# Altium schematic sheet Function Genetrator off.SchDoc
size A1; SheetNumber: 1; SheetTotal: 1
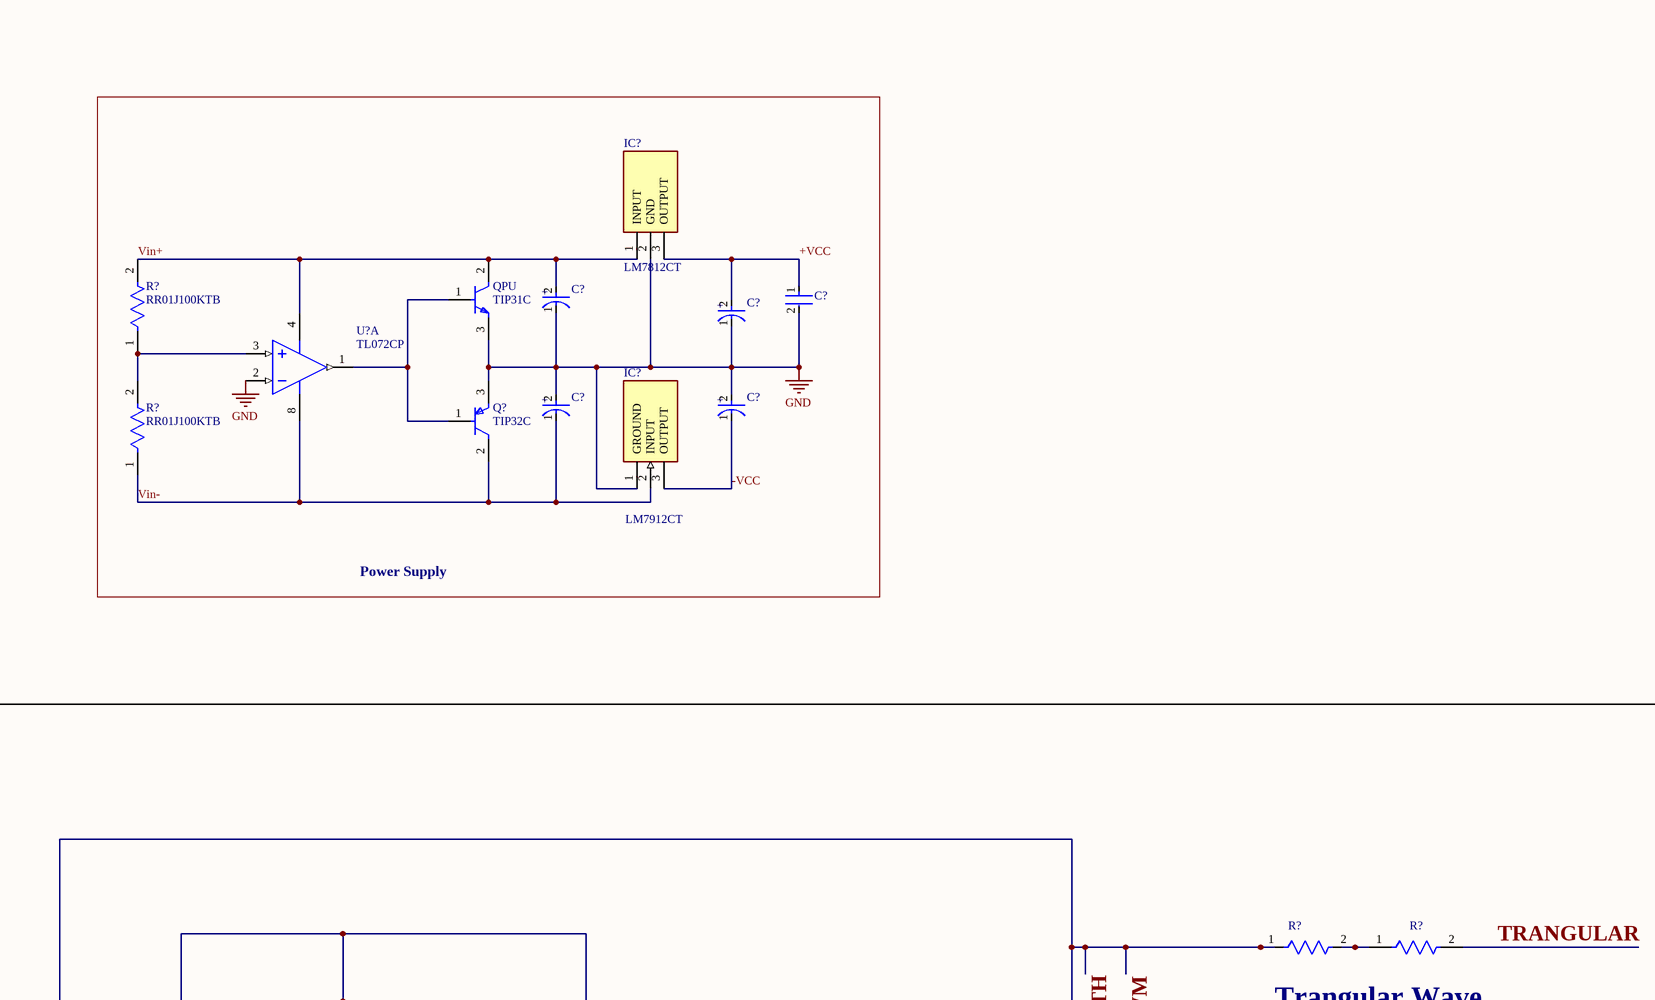
[diagram p0: Function Genetrator off.SchDoc, top left]
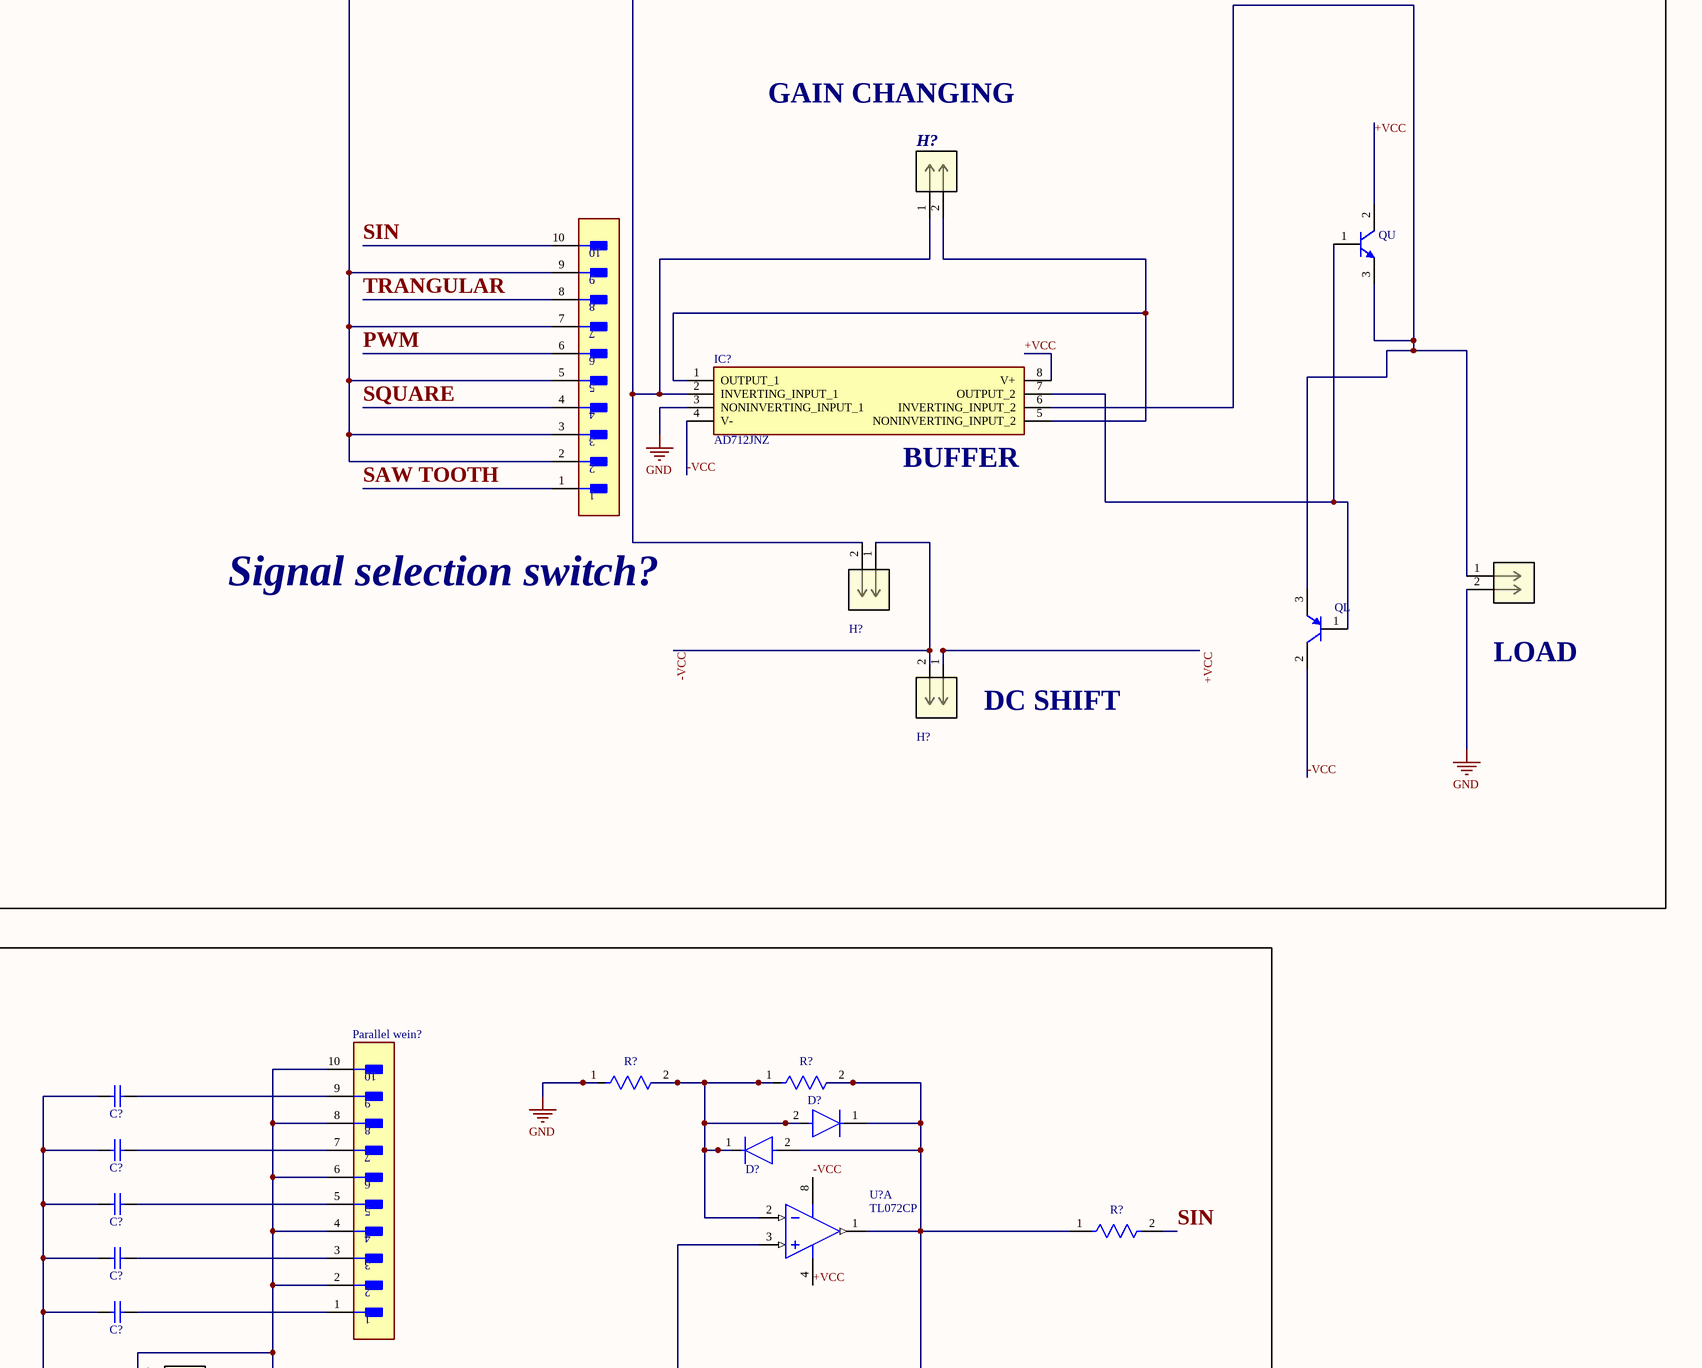
[diagram p1: Function Genetrator off.SchDoc, top right]
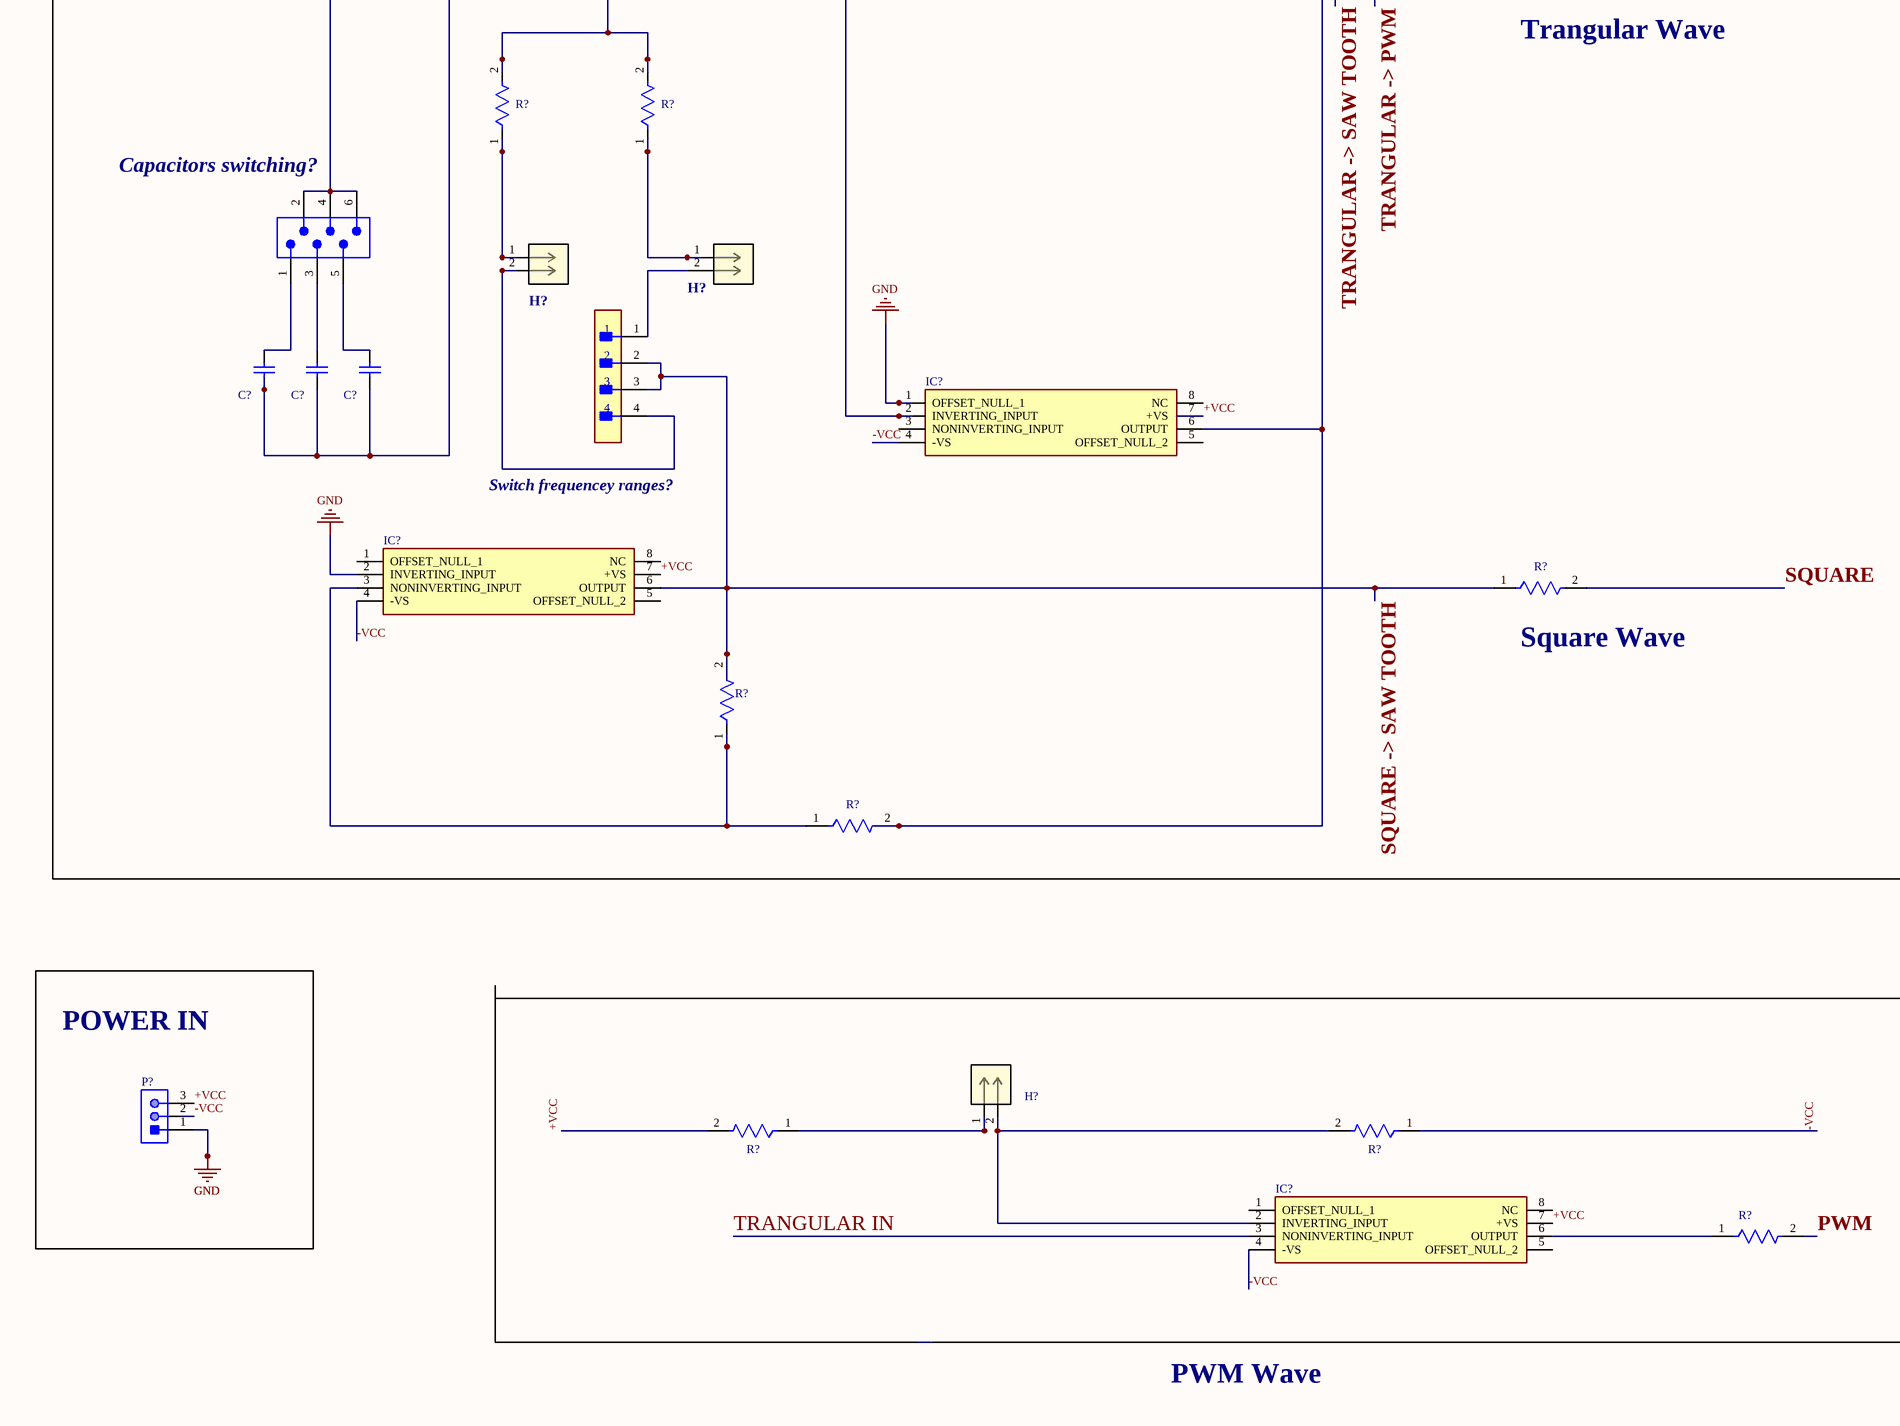
[diagram p2: Function Genetrator off.SchDoc, bottom left]
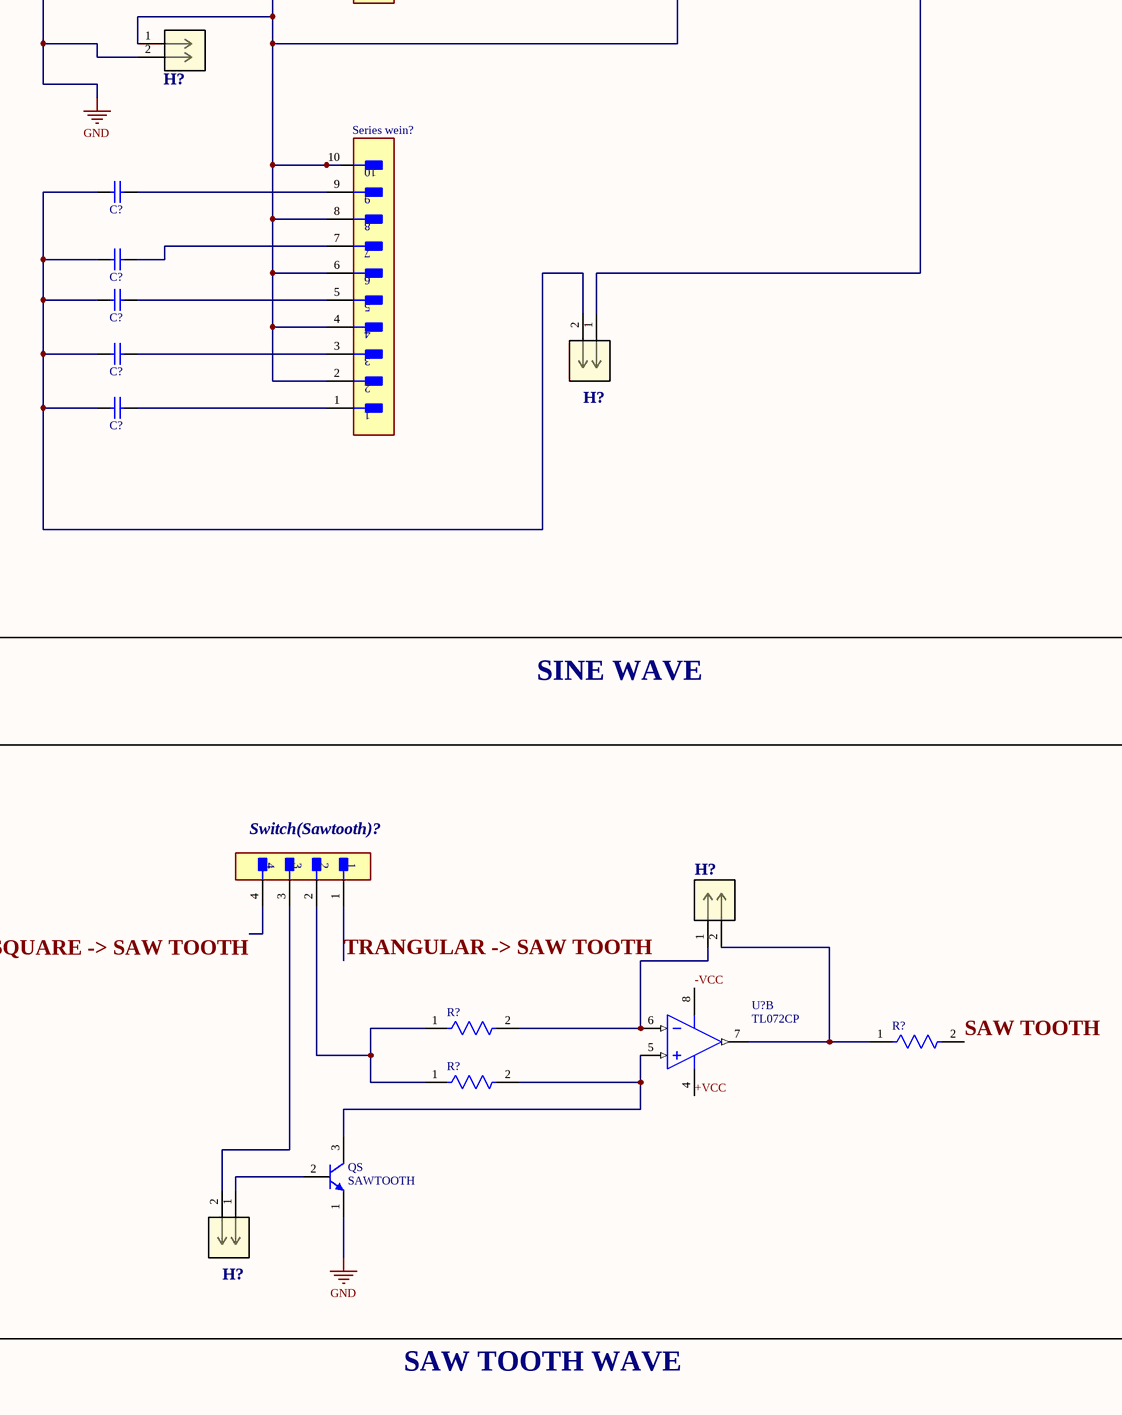
[diagram p3: Function Genetrator off.SchDoc, bottom right]

## Parts
(Parts that share a designator on the sheet are numbered #1, #2 ... from top to bottom, then left to right.)
C?#1  EEUFR1E391L  [FP-RAD-TH-D_8_0_5-L_15_1-MFG]  (value not drawn)
C?#2  RCER72A104K1A2H03B  [FP-RCE1A2-MFG]  (value not drawn)
C?#3  EEUFR1E391L  [FP-RAD-TH-D_8_0_5-L_15_1-MFG]  (value not drawn)
C?#4  EEUFR1E391L  [FP-RAD-TH-D_8_0_5-L_15_1-MFG]  (value not drawn)
C?#5  EEUFR1E391L  [FP-RAD-TH-D_8_0_5-L_15_1-MFG]  (value not drawn)
C?#6  10uF  [KEMT-C333C105M5U5TA-2]  (value not drawn)
C?#7  1uF  [KEMT-C333C105M5U5TA-2]  (value not drawn)
C?#8  100nF  [KEMT-C333C105M5U5TA-2]  (value not drawn)
C?#9  10nF  [KEMT-C333C105M5U5TA-2]  (value not drawn)
C?#10  1nF  [KEMT-C333C105M5U5TA-2]  (value not drawn)
C?#11  10uF  [KEMT-C333C105M5U5TA-2]  (value not drawn)
C?#12  1uF  [KEMT-C333C105M5U5TA-2]  (value not drawn)
C?#13  100nF  [KEMT-C333C105M5U5TA-2]  (value not drawn)
C?#14  10nF  [KEMT-C333C105M5U5TA-2]  (value not drawn)
C?#15  1uF  [KEMT-C333C105M5U5TA-2]  (value not drawn)
C?#16  0.1uF  [KEMT-C333C105M5U5TA-2]  (value not drawn)
C?#17  0.01uF  [KEMT-C333C105M5U5TA-2]  (value not drawn)
C?#18  1nF  [KEMT-C333C105M5U5TA-2]  (value not drawn)
Capacitors_switching?  690357100672  [690357100672]  (value not drawn)
D?#1  1N4148  [FP-017AG-MFG]  (value not drawn)
D?#2  1N4148  [FP-017AG-MFG]  (value not drawn)
H?#1  100kohm potentiometer  [2Pins_AMP]  (value not drawn)
H?#2  10Kohm Potentiometer  [2Pins_AMP]  (value not drawn)
H?#3  10Kohm Potentiometer  [2Pins_AMP]  (value not drawn)
H?#4  10Kohm potentiometer  [2Pins_AMP]  (value not drawn)
H?#5  10KOHM POTENTIOMETER  [2Pins_AMP]  (value not drawn)
H?#6  200KOHM POTENTIOMETER  [2Pins_AMP]  (value not drawn)
H?#7  10Kohm potentiometer  [2Pins_AMP]  (value not drawn)
H?#8  10Kohm potentiometer  [2Pins_AMP]  (value not drawn)
H?#9  5Kohm Potentiometer  [2Pins_AMP]  (value not drawn)
H?#10  100KOHM POTENTIOMETER  [2Pins_AMP]  (value not drawn)
IC?#1  AD712JNZ  [DIP794W56P254L959H533Q8N]
IC?#2  LM7812CT  [TO254P470X1016X2019-3P]
IC?#3  LM7912CT  [TO254P483X1016X2261-3P]
IC?#4  AD711JN  [DIP794W56P254L928H457Q8N]  (value not drawn)
IC?#5  AD711JN  [DIP794W56P254L928H457Q8N]  (value not drawn)
IC?#6  AD711JN  [DIP794W56P254L928H457Q8N]  (value not drawn)
LOAD  67997-402HLF  [2Pins_AMP]  (value not drawn)
P?  292161-3  [TECO-292161-3_V]  (value not drawn)
Parallel_wein?  in 1  [FP-4-644456-0-MFG]  (value not drawn)
Q?  TIP32C  [FP-TO-220-P0A0015988-MFG]
QL  TIP32A  [ONSC-TO-220-3-221A-09]  (value not drawn)
QPU  TIP31C  [FP-TO-220-P0A0015988-MFG]
QS  SAWTOOTH  [FAIR-TO-92]
QU  TIP31A  [ONSC-TO-220-3-221A-09]  (value not drawn)
R?#1  RR01J100KTB  [FP-RR01-MFG]
R?#2  RR01J100KTB  [FP-RR01-MFG]
R?#3  5K  [FP-MBB0207-MFG]  (value not drawn)
R?#4  10K  [FP-MBB0207-MFG]  (value not drawn)
R?#5  0.5K  [FP-MBB0207-MFG]  (value not drawn)
R?#6  6.8K  [FP-MBB0207-MFG]  (value not drawn)
R?#7  10K  [FP-MBB0207-MFG]  (value not drawn)
R?#8  150ohm  [FP-RLR07-MFG]  (value not drawn)
R?#9  10K  [FP-RLR07-MFG]  (value not drawn)
R?#10  10K  [FP-MBB0207-MFG]  (value not drawn)
R?#11  1K  [FP-MBB0207-MFG]  (value not drawn)
R?#12  150OHM  [FP-MBB0207-MFG]  (value not drawn)
R?#13  10K  [FP-MBB0207-MFG]  (value not drawn)
R?#14  10k  [FP-MBB0207-MFG]  (value not drawn)
R?#15  10K  [FP-MBB0207-MFG]  (value not drawn)
R?#16  10K  [FP-MBB0207-MFG]  (value not drawn)
R?#17  10K  [FP-MBB0207-MFG]  (value not drawn)
R?#18  68Kohm  [FP-MBB0207-MFG]  (value not drawn)
Series_wein?  in2  [FP-4-644456-0-MFG]  (value not drawn)
Signal_selection_switch?  4-644456-0  [FP-4-644456-0-MFG]  (value not drawn)
Switch(Sawtooth)?  HTSW-102-07-G-D  [FP-HTSW-102-07-G-D-MFG]  (value not drawn)
Switch_frequencey_ranges?  FREQ  [FP-HTSW-102-07-G-D-MFG]  (value not drawn)
U?#1  TL072CP  [P0008A]  (part A of 2)
U?#2  TL072CP  [P0008A]  (part A of 2)
U?#3  TL072CP  [P0008A]  (part B of 2)

## Blocks framed on the sheet
Power Supply: C?#1-C?#5 IC?#2 IC?#3 Q? QPU R?#1 R?#2 U?#1
POWER IN: P?

## Nets
GND: C?#1.1(C) C?#2.2 C?#3.1(C) C?#4.2(A) C?#5.2(A) C?#6.2 C?#7.2 C?#8.2 C?#9.2 C?#10.2 H?#4.2 IC?#1.3(NONINVERTING_INPUT_1) IC?#2.2(GND) IC?#3.1(GROUND) IC?#4.1(OFFSET_NULL_1) IC?#5.2(INVERTING_INPUT) LOAD.2 P?.1 Q?.3(E) QPU.3(E) QS.1(E) R?#3.1 U?#1.2(IN1-)
+VCC: C?#2.1 C?#3.2(A) H?#3.1 IC?#1.8(V+) IC?#2.3(OUTPUT) IC?#4.7(+VS) IC?#5.7(+VS) IC?#6.7(+VS) P?.3 QU.2(C) R?#16.2 U?#2.4(VCC-) U?#3.4(VCC-)
-VCC: C?#5.1(C) H?#2.1 H?#3.2 IC?#1.4(V-) IC?#3.3(OUTPUT) IC?#4.4(-VS) IC?#5.4(-VS) IC?#6.4(-VS) P?.2 QL.2(C) R?#17.1 U?#2.8(VCC+) U?#3.8(VCC+)
PWM: R?#18.2 Signal_selection_switch?.6
SAW TOOTH: R?#14.2 Signal_selection_switch?.1
SIN: R?#5.2 Signal_selection_switch?.10
SQUARE: R?#10.2 Signal_selection_switch?.4
SQUARE -> SAW TOOTH: IC?#5.6(OUTPUT) R?#10.1 R?#11.2 Switch(Sawtooth)?.4 Switch_frequencey_ranges?.2 Switch_frequencey_ranges?.3
TRANGULAR: R?#7.2 Signal_selection_switch?.8
TRANGULAR -> PWM: Capacitors_switching?.2 Capacitors_switching?.4 Capacitors_switching?.6 IC?#4.6(OUTPUT) R?#6.1 R?#12.2 Switch(Sawtooth)?.1  [also labelled TRANGULAR -> SAW TOOTH]
TRANGULAR IN: IC?#6.3(NONINVERTING_INPUT)
Vin+: C?#1.2(A) IC?#2.1(INPUT) QPU.2(C) R?#1.2 U?#1.4(VCC-)
Vin-: C?#4.1(C) IC?#3.2(INPUT) Q?.2(C) R?#2.1 U?#1.8(VCC+)
NetC?#6_1: C?#6.1 Parallel_wein?.9
NetC?#7_1: C?#7.1 Parallel_wein?.7
NetC?#8_1: C?#8.1 Parallel_wein?.5
NetC?#9_1: C?#9.1 Parallel_wein?.3
NetC?#10_1: C?#10.1 Parallel_wein?.1
NetC?#11_1: C?#11.1 Series_wein?.9
NetC?#11_2: C?#11.2 C?#12.2 C?#13.2 C?#14.2 C?#18.2 H?#7.2
NetC?#12_1: C?#12.1 Series_wein?.7
NetC?#13_1: C?#13.1 Series_wein?.5
NetC?#14_1: C?#14.1 Series_wein?.3
NetC?#15_1: C?#15.1 C?#16.1 C?#17.1 IC?#4.2(INVERTING_INPUT) R?#8.2 R?#9.2
NetC?#15_2: C?#15.2 Capacitors_switching?.1
NetC?#16_2: C?#16.2 Capacitors_switching?.3
NetC?#17_2: C?#17.2 Capacitors_switching?.5
NetC?#18_1: C?#18.1 Series_wein?.1
NetD?#1_1: D?#1.1(C) D?#2.2(A) H?#7.1 R?#4.2 R?#5.1 U?#2.1(OUT1)
NetD?#1_2: D?#1.2(A) D?#2.1(C) R?#3.2 R?#4.1 U?#2.2(IN1-)
NetH?#1_1: H?#1.1 H?#2.2 IC?#1.2(INVERTING_INPUT_1) Signal_selection_switch?.2 Signal_selection_switch?.3 Signal_selection_switch?.5 Signal_selection_switch?.7 Signal_selection_switch?.9
NetH?#1_2: H?#1.2 IC?#1.1(OUTPUT_1) IC?#1.5(NONINVERTING_INPUT_2)
NetH?#4_1: H?#4.1 Parallel_wein?.2 Parallel_wein?.4 Parallel_wein?.6 Parallel_wein?.8 Parallel_wein?.10 Series_wein?.2 Series_wein?.4 Series_wein?.6 Series_wein?.8 Series_wein?.10 U?#2.3(IN1+)
NetH?#5_1: H?#5.1 R?#8.1
NetH?#5_2: H?#5.2 Switch_frequencey_ranges?.4
NetH?#6_1: H?#6.1 R?#9.1
NetH?#6_2: H?#6.2 Switch_frequencey_ranges?.1
NetH?#8_1: H?#8.1 R?#13.2 U?#3.6(IN2-)
NetH?#8_2: H?#8.2 R?#14.1 U?#3.7(OUT2)
NetH?#9_1: H?#9.1 R?#16.1
NetH?#9_2: H?#9.2 IC?#6.2(INVERTING_INPUT) R?#17.2
NetH?#10_1: H?#10.1 QS.2(B)
NetH?#10_2: H?#10.2 Switch(Sawtooth)?.3
NetIC?#1_6: IC?#1.6(INVERTING_INPUT_2) LOAD.1 QL.3(E) QU.3(E)
NetIC?#1_7: IC?#1.7(OUTPUT_2) QL.1(B) QU.1(B)
NetIC?#5_3: IC?#5.3(NONINVERTING_INPUT) R?#11.1 R?#12.1
NetIC?#6_6: IC?#6.6(OUTPUT) R?#18.1
NetQ?_1: Q?.1(B) QPU.1(B) U?#1.1(OUT1)
NetQS_3: QS.3(C) R?#15.2 U?#3.5(IN2+)
NetR?#1_1: R?#1.1 R?#2.2 U?#1.3(IN1+)
NetR?#6_2: R?#6.2 R?#7.1
NetR?#13_1: R?#13.1 R?#15.1 Switch(Sawtooth)?.2

Not connected (* = marked no-connect by the designer): IC?#4 3(NONINVERTING_INPUT) 5(OFFSET_NULL_2) 8(NC); IC?#5 1(OFFSET_NULL_1) 5(OFFSET_NULL_2) 8(NC); IC?#6 1(OFFSET_NULL_1) 5(OFFSET_NULL_2) 8(NC)

## Notes on the sheet
- GAIN CHANGING
- (near IC?#1) BUFFER
- (near H?#3) DC SHIFT
- (near R?#7) Trangular Wave
- (near R?#10) Square Wave
- SINE WAVE
- PWM Wave
- SAW TOOTH WAVE
- (in symbol CMP-05427-000460-1) +

## Library data of the parts
C?#1 C?#3-C?#5 = CMP-05427-000460-1: Aluminum Electrolytic Capacitors (Radial Lead Type) 390uF ±20% 25V; Impedance: 41mR; Lead Diameter: 0.6mm; Ripple Current (AC): 1.24A; Life (Hours): 8000Hour; Dielectric Material: Aluminium; Length: 15mm; Case/Package: Radial; Termination: Radial; Tolerance: 20%; Series: FR; RoHS Compliant: Yes; Height: 15mm; Package Quantity: 200; Construction: RADIAL; Diameter: 8mm; Mount: Through Hole; REACH SVHC: No SVHC; Voltage Rating: 25V; Packaging: Bulk; ESR (Equivalent Series Resistance): 41mR; Min Operating Temperature: -40°C; Ripple Current: 1.24A; Max Operating Temperature: 105°C; Lead Pitch: 3.5mm; Radiation Hardening: No; Capacitance: 390uF; Voltage: 25V; Number of Pins: 2; Height - Seated (Max): 0.65inch; Voltage Rating (DC): 25V
C?#2 = CMP-06035-023167-1: Cap Ceramic 100nF 100V X7R ±10% Radial 2.5mm +125°C Automotive Bulk; Lead Diameter: 0.5mm; Lead/Base Style: Straight; Resistor Type: Ceramic; Ratings: AEC-Q200; Mount: Through Hole; Termination: Radial; Capacitance: 100nF; Voltage Rating (DC): 100V; Max Operating Temperature: 125°C; Min Operating Temperature: -55°C; Case/Package: Radial; Tolerance: 10%; Length: 0.157inch; Voltage Rating: 100V; Width: 0.098inch; Packaging: Bulk; Package Quantity: 500; Lead Free: Lead Free; Height: 3.5mm; Dielectric: X7R; Height - Seated (Max): 0.138inch; Lead Pitch: 0.098inch
C?#6 C?#8-C?#11 C?#13 C?#14 C?#16-C?#18 = CMP-2000-05174-1: Multilayer Ceramic Capacitor / Axial and Radial Leaded, 1 uF, +/- 20%, 10 to 85 degC, 2-Pin THD, RoHS, Bulk; Manufacturer: Kemet; Voltage Rating: 50V; Temperature Coefficient / Code: Z5U; Case Height: 3.81mm; Lead Diameter: 0.51mm; Case Style: ConformallyCoated; Dissipation Factor DF: 4; Capacitance: 1uF; Case Length: 9.91mm; Type: RadialLeads; Case Width: 7.62mm; Dimensions: 7.62mmWx9.91mmLx3.81mmH; Termination Style: Radial; Factory Pack Quantity: 250; Packaging: Bulk; RoHS: Details; Datasheet Version: Jul-09; Lead Spacing: 5.08mm; Product Category: MultilayerCeramicCapacitorsMLCC-Leaded; Maximum Operating Temperature: +125C; Product: GeneralTypeMLCCs; Manufacturer URL: http://www.kemet.com/; Lead Style: InsideBend; Operating Temperature Range: -55Cto+125C; Datasheet URL: http://www.farnell.com/datasheets/706880.pdf; Voltage Rating DC: 50V; Brand: Kemet; Series: C333; Tolerance: 20%; Minimum Operating Temperature: -55C
C?#7 C?#12 C?#15 = CMP-2000-05174-1: Multilayer Ceramic Capacitor / Axial and Radial Leaded, 1 uF, +/- 20%, 10 to 85 degC, 2-Pin THD, RoHS, Bulk; Manufacturer: Kemet; Voltage Rating: 50V; Temperature Coefficient / Code: Z5U; Case Height: 3.81mm; Lead Diameter: 0.51mm; Case Style: ConformallyCoated; Dissipation Factor DF: 4; Case Length: 9.91mm; Type: RadialLeads; Case Width: 7.62mm; Dimensions: 7.62mmWx9.91mmLx3.81mmH; Termination Style: Radial; Factory Pack Quantity: 250; Packaging: Bulk; RoHS: Details; Datasheet Version: Jul-09; Lead Spacing: 5.08mm; Product Category: MultilayerCeramicCapacitorsMLCC-Leaded; Maximum Operating Temperature: +125C; Product: GeneralTypeMLCCs; Manufacturer URL: http://www.kemet.com/; Capacitance: 1uF; Lead Style: InsideBend; Operating Temperature Range: -55Cto+125C; Datasheet URL: http://www.farnell.com/datasheets/706880.pdf; Voltage Rating DC: 50V; Brand: Kemet; Series: C333; Tolerance: 20%; Minimum Operating Temperature: -55C
Capacitors_switching? = CMP-1502-00902-2: NexarPartId: 8917654; Contact Resistance: 10mΩ; Number of Positions: 6; Gender: Male; Row Spacing: 2.54mm; Current Rating: 1.5A; Connector Type: Male Pin; Insulation: Insulated; Insulation Resistance: 1GΩ; Voltage Rating: 100V; Length: 9.65mm; Mount: Through Hole; Lead Pitch: 2.54mm; Orientation: Straight; Min Operating Temperature: -40°C; Max Operating Temperature: 105°C; Insulation Material: PBT; Termination: Through Hole; REACH SVHC: Unknown; Pitch: 2.54mm; Number of Rows: 2; Color: Red; Contact Plating: Tin; Flammability Rating: UL94 V-0; Housing Material: PBT; Number of Pins: 6; Contact Material: Bronze; Number of Contacts: 6; RoHS: Compliant; Contact Gender: Male; Operating Supply Voltage: 100V; Height: 7mm
D?#1 D?#2 = CMP-07163-000046-1: DIODE GEN PURP 100V 200MA DO35; Forward Voltage: 1V; Max Power Dissipation: 500mW; Max Reverse Current: 5uA; Forward Current: 300mA; Current: 4A; Reverse Recovery Time: 4ns; Element Configuration: Single; Outside Diameter: 1.85mm; Capacitance: 4pF; Polarity: Standard; Max Forward Surge Current (Ifsm): 1A; Reverse Voltage: 100V; Output Current: 200mA; Average Rectified Current: 200mA; Diameter: 1.91mm; Max Repetitive Reverse Voltage (Vrrm): 100V; Current Rating: 200mA; Case/Package: DO-35; Lead Free: Lead Free; Number of Pins: 2; Recovery Time: 4ns; Packaging: Bulk; Contact Plating: Tin; Voltage: 100V; Mount: Through Hole; Max Surge Current: 4A; Package Quantity: 2000; Width: 1.91mm; Max Reverse Voltage (DC): 100V; Length: 4.56mm; Radiation Hardening: No; Power Dissipation: 500mW; Voltage Rating (DC): 100V; Peak Non-Repetitive Surge Current: 4A; REACH SVHC: No SVHC; Height: 4.56mm; Max Operating Temperature: 175°C; Series: -; Weight: 0.01lb; Min Operating Temperature: -65°C
H?#1-H?#10 LOAD = 67997-402HLF: No Description Available; Mfr_Name: Amphenol ICC; RefDes: RefDes; Type: Type
IC?#1 = AD712JNZ: Integrated Circuit; Manufacturer_Name: Analog Devices; Datasheet Link: https://datasheet.datasheetarchive.com/originals/distributors/Datasheets-1/DSA-2049.pdf; Height: 5.33mm; Manufacturer_Part_Number: AD712JNZ; Mouser Part Number: 584-AD712JNZ; Mouser Price/Stock: https://www.mouser.co.uk/ProductDetail/Analog-Devices/AD712JNZ?qs=NmRFExCfTkHkv4a3jawdPw%3D%3D; Arrow Part Number: AD712JNZ; Arrow Price/Stock: https://www.arrow.com/en/products/ad712jnz/analog-devices?region=nac
IC?#2 = LM7812CT: Integrated Circuit; Manufacturer_Name: onsemi; Datasheet Link: https://datasheet.datasheetarchive.com/originals/distributors/Datasheets_SAMA/704b005d7d2d9ced5864f40b6609c1bc.pdf; Height: 4.7mm; Manufacturer_Part_Number: LM7812CT; Mouser Part Number: 512-LM7812CT; Mouser Price/Stock: https://www.mouser.co.uk/ProductDetail/ON-Semiconductor-Fairchild/LM7812CT?qs=VOMQJJE%252BBNkfAU1Xmn60XA%3D%3D; Arrow Part Number: LM7812CT; Arrow Price/Stock: https://www.arrow.com/en/products/lm7812ct/on-semiconductor
IC?#3 = LM7912CT: Power Supply; Manufacturer_Name: onsemi; Datasheet Link: https://componentsearchengine.com/Datasheets/2/LM7912CT.pdf; Height: 4.83mm; Manufacturer_Part_Number: LM7912CT; Mouser Part Number: 512-LM7912CT; Mouser Price/Stock: https://www.mouser.com/Search/Refine.aspx?Keyword=512-LM7912CT; Arrow Part Number: LM7912CT; Arrow Price/Stock: https://www.arrow.com/en/products/lm7912ct/on-semiconductor
IC?#4-IC?#6 = AD711JN: Integrated Circuit; Manufacturer_Name: Analog Devices; Datasheet Link: https://www.analog.com/media/en/technical-documentation/data-sheets/AD711.pdf; Height: 4.57mm; Manufacturer_Part_Number: AD711JN
P? = CMP-2000-05551-1: Male Header, Pitch 2 mm, 1 x 3 Position, Height 6.8 mm, Tail Length 3.2 mm, -40 to 105 degC, RoHS, Bulk; Manufacturer: TE Connectivity; SVHC: NoSVHC(15-Jun-2015); Pitch Spacing: 2mm; Contact Termination Type: ThroughHole; No. of Rows: 1Rows; No. of Contacts: 3Contacts; Product Range: AMPCTSeries; Mounting Technology: ThroughHole; Manufacturer URL: http://www.te.com/; Contact Material: Brass; Datasheet URL: http://www.te.com/commerce/DocumentDelivery/DDEController?Action=showdoc&DocId=Customer+Drawing%7F292161%7FP1%7Fpdf%7FEnglish%7FENG_CD_292161_P1.pdf%7F292161-3; Package Reference: 292161-3; Contact Plating: TinPlatedContacts; Gender: Header; Datasheet Version: Rev. P1, 06/2016; Package Description: Male Header, Pitch 2 mm, 1 x 3 Position, Height 6.8 mm, Tail Length 3.2 mm
Parallel_wein? Series_wein? = CMP-03369-000038-1: CONN HEADER VERT 10POS 2.54MM; Manufacturer Part Number: 4-644456-0; Manufacturer: TE Connectivity; Current Rating: 5A; Conn Gender: Male; Number Of Contacts: 10; Conn Orientation: Vertical; Voltage Rating: 250V; Number Of Rows: 1; Device Class L3: unset; Octopart: https://octopart.com/4-644456-0-te+connectivity-39514173; Pitch: 2.54mm; Mouser Description: Headers & Wire Housings NARROW FLT HDR 10P Straight Post; ComponentLink2Description: Datasheet; Height: 0.408inch; Package: 4-644456-0; RoHS: TRUE; Temperature Range High: +105°C; Digikey Description: CONN HEADER VERT 10POS 2.54MM; Temperature: -55°C to +105°C; Device Class L2: Headers and Wire Housings; Automotive: No; Lead Free: Yes; Contact Material: Tin; Temperature Range Low: -55°C; Footprint Url: https://www.te.com/commerce/DocumentDelivery/DDEController?Action=showdoc&DocId=Customer+Drawing%7F644456%7FD2%7Fpdf%7FEnglish%7FENG_CD_644456_D2.pdf%7F4-644456-0; Device Class L1: Connectors; Category: Conn; ComponentLink2URL: https://www.te.com/commerce/DocumentDelivery/DDEController?Action=showdoc&DocId=Data+Sheet%7F82056_MTA%7F0818%7Fpdf%7FEnglish%7FENG_DS_82056_MTA_0818.pdf%7F4-644456-0
Q? = CMP-12195-000005-1: TRANS PNP 100V 3A TO-220; Manufacturer: STMicroelectronics; Standoff Height: 3.5mm; Number Of Pnp: 1; Max Collector Current: -3A; Emitter Base Voltage: -5V; Collector Emitter Voltage: -100V; Hfe Testvce: -4V; Hfe Max: 50; Collector Emitter Saturation Voltage: -1.2V; Power Dissipation: 2W; Max Junction Temp: +150°C; Hfe Min: 10; Device Class L3: BJTs; Mouser Description: Original ST Microelectronics Transistor, 100V, 3A, .22 Ohm, TO-220 Package; ComponentLink2Description: Datasheet; Device Class L1: Discrete Semiconductors; Automotive: No; Number Of Elements: 1; Category: Trans; Collector Base Voltage: -100V; Package: TO-220-P0A0015988; Height: 19.68mm; Lead Free: Yes; ComponentLink2URL: https://www.st.com/resource/en/datasheet/tip32c.pdf; Hfe Testic: -3A; RoHS: TRUE; Temperature Range High: +150°C; Temperature: to +150°C; Device Class L2: Transistors; Digikey Description: TRANS PNP 100V 3A TO-220; Octopart: https://octopart.com/tip32c-stmicroelectronics-353617; Manufacturer Part Number: TIP32C
QL = CMP-1048-01079-1: Complementary Silicon Plastic Power Transistor, 3-Pin TO-220, Tube; Manufacturer: On Semiconductor; Polarity: PNP; IC Continuous (A): 3; ComponentLink3Description: Package Specification; ComponentLink2URL: http://www.onsemi.com/pub_link/Collateral/TIP31A-D.PDF; PackageDescription: 3-Pin Flange Mount, Vertical Straight Lead, Body 9.97 x 4.445 mm, Pitch 2.54 mm; PackageVersion: Rev. AG, 09/2011; Mounting Technology: Through Hole; RoHS: FALSE; ComponentLink1URL: http://www.onsemi.com/; ComponentLink2Description: Datasheet; PackageReference: TO-220-3-221A-09; fT Min (MHz): 3; ComponentLink1Description: Manufacturer URL; PartNumber: TIP32A; DatasheetVersion: Rev. 14; Packing: Tube; ComponentLink3URL: http://www.onsemi.com/pub_link/Collateral/221A-09.PDF
QPU = CMP-12195-000001-1: TRANS NPN 100V 3A TO-220; Manufacturer: STMicroelectronics; Hfe Max: 50; Number Of Npn: 1; Max Junction Temp: +150°C; Standoff Height: 3.5mm; Emitter Base Voltage: 5V; Collector Emitter Saturation Voltage: 1.2V; Power Dissipation: 2W; Hfe Testvce: 4V; Hfe Min: 10; Device Class L2: Transistors; ComponentLink2URL: https://www.st.com/resource/en/datasheet/tip31c.pdf; Device Class L1: Discrete Semiconductors; Digikey Description: TRANS NPN 100V 3A TO-220; Max Collector Current: 3A; RoHS: TRUE; Height: 19.68mm; Mouser Description: Bipolar Transistors - BJT NPN Gen Pur Power; Number Of Elements: 1; Package: TO-220-P0A0015988; Temperature: to +150°C; Octopart: https://octopart.com/tip31c-stmicroelectronics-15555; Manufacturer Part Number: TIP31C; Category: Trans; Hfe Testic: 3A; Lead Free: Yes; Collector Base Voltage: 100V; Device Class L3: BJTs; Collector Emitter Voltage: 100V; Automotive: No; ComponentLink2Description: Datasheet; Temperature Range High: +150°C
QS = CMP-2000-04944-1: NPN General-Purpose Amplifier, 40 V VCEO, 0.2 A, -55 to 150 degC, 2-Pin TO-92, RoHS, Bulk; Manufacturer: FairchildSemiconductor; Maximum Collector Base Voltage: 60V; Minimum DC Current Gain: 40@0.1mA@1V; Maximum Collector Emitter Voltage: 40V; Maximum DC Collector Current: 0.2A; Rad Hard: No; Maximum Operating Frequency: 300(Min)MHz; Maximum Collector Emitter Saturation Voltage: 0.2@1mA@10mA; Maximum Power Dissipation: 625mW; Package Description: 3-Pin Transistor Outline Package, Body Dia 4.79 mm, Pitch 1.27 mm; Package Reference: TO-92; Pin Count: 3; Operating Temperature: -55to150degC; Category: GPBJT; Manufacturer URL: https://www.fairchildsemi.com/; Datasheet URL: https://datasheet.ciiva.com/4722/2n3904-82270-4722369.pdf; Package: 3TO-92; Packaging: Bulk; Type: NPN; Datasheet Version: Rev. 1.1.0, 10/2014; Mounting: ThroughHole
QU = CMP-1048-01124-1: Complementary Silicon Plastic Power Transistor, 3-Pin TO-220, Tube; Manufacturer: On Semiconductor; IC Continuous (A): 3; Polarity: NPN; ComponentLink2Description: Datasheet; Mounting Technology: Through Hole; DatasheetVersion: Rev. 14; ComponentLink1URL: http://www.onsemi.com/; PackageReference: TO-220-3-221A-09; ComponentLink3URL: http://www.onsemi.com/pub_link/Collateral/221A-09.PDF; Packing: Tube; PartNumber: TIP31A; ComponentLink3Description: Package Specification; ComponentLink1Description: Manufacturer URL; PackageVersion: Rev. AG, 09/2011; ComponentLink2URL: http://www.onsemi.com/pub_link/Collateral/TIP31A-D.PDF; PackageDescription: 3-Pin Flange Mount, Vertical Straight Lead, Body 9.97 x 4.445 mm, Pitch 2.54 mm; fT Min (MHz): 3; RoHS: FALSE
R?#1 R?#2 = CMP-03212-000008-1: RES 100K OHM 5% 1W AXIAL; Number of Resistors: 1; Temperature Coefficient: 300ppm/°C; Voltage Rating: 350V; Resistance: 100kR; Package Quantity: 5000; Power Rating: 1W; Packaging: Ammo Pack; Min Operating Temperature: -55°C; Number of Terminations: 2; Resistor Type: Power resistor; Length: 6.8mm; ELV: Compliant; Mount: Axial; RoHS Compliant: Yes; Case/Package: Metal; Diameter: 2.6mm; Termination: Axial; Series: RR; Max Operating Temperature: 155°C; Tolerance: 5%
R?#3-R?#7 R?#10-R?#18 = CMP-02408-000035-1: RES 10K OHM 0.6W 1% AXIAL; Voltage Rating: 300V; Resistance: 10kR; Max Power Dissipation: 600mW; Temperature Coefficient: 50ppm/°C; Radiation Hardening: No; Case/Package: Conformal; Termination: Axial; Military Standard: Not; Length: 6.5mm; Voltage Rating (DC): 300V; RoHS Compliant: Yes; Number of Terminations: 2; Packaging: Tape and Reel; Features: Automotive AEC-Q200; Tolerance: 1%; Min Operating Temperature: -55°C; Power Rating: 600mW; Lead Free: Lead Free; Resistor Type: Metal Film; Construction: Cylindrical; Series: MBB 0207 - Professional; Max Operating Temperature: 155°C; Diameter: 2.5mm; Resistance Tolerance: 1%; Contact Plating: Tin; Technology: THIN FILM
R?#8 R?#9 = CMP-00030-41139779-1: RLR07C7501GSB14 Res Metal Film 7.5K Ohm 2% 1/4W ±100ppm/°C 0.001% Conformal AXL Thru-Hole Bulk; Resistance: 7.5kΩ; Voltage Rating: 250V; Power Rating: 250mW; Military Standard: MIL-PRF-39017; Tolerance: 2%; Width: 2.29mm; Case/Package: Axial; Failure Rate: 0.001%; Composition: Metal Film; Height: 2.5mm; Max Operating Temperature: 150°C; Termination: Axial; Schedule B: 8533210090, 8533210090; Number of Terminations: 2; Voltage Rating (DC): 250V; RoHS: Non-Compliant; Mount: Through Hole; Packaging: Bulk; Features: Military, Moisture Resistant, Weldable; Min Operating Temperature: -65°C; Length: 7.62mm; Diameter: 2.29mm; Lead Free: Contains Lead; Max Power Dissipation: 250mW; Temperature Coefficient: 100ppm/°C; Contact Plating: Lead, Tin; NexarPartId: 41139779
Signal_selection_switch? = CMP-03369-000038-1: CONN HEADER VERT 10POS 2.54MM; Manufacturer: TE Connectivity; Current Rating: 5A; Conn Gender: Male; Number Of Contacts: 10; Conn Orientation: Vertical; Voltage Rating: 250V; Number Of Rows: 1; Device Class L3: unset; Octopart: https://octopart.com/4-644456-0-te+connectivity-39514173; Pitch: 2.54mm; Mouser Description: Headers & Wire Housings NARROW FLT HDR 10P Straight Post; ComponentLink2Description: Datasheet; Height: 0.408inch; Package: 4-644456-0; RoHS: TRUE; Temperature Range High: +105°C; Digikey Description: CONN HEADER VERT 10POS 2.54MM; Temperature: -55°C to +105°C; Device Class L2: Headers and Wire Housings; Automotive: No; Lead Free: Yes; Contact Material: Tin; Manufacturer Part Number: 4-644456-0; Temperature Range Low: -55°C; Footprint Url: https://www.te.com/commerce/DocumentDelivery/DDEController?Action=showdoc&DocId=Customer+Drawing%7F644456%7FD2%7Fpdf%7FEnglish%7FENG_CD_644456_D2.pdf%7F4-644456-0; Device Class L1: Connectors; Category: Conn; ComponentLink2URL: https://www.te.com/commerce/DocumentDelivery/DDEController?Action=showdoc&DocId=Data+Sheet%7F82056_MTA%7F0818%7Fpdf%7FEnglish%7FENG_DS_82056_MTA_0818.pdf%7F4-644456-0
Switch(Sawtooth)? = CMP-02766-000010-1: CONN HEADER VERT 4POS 2.54MM; Manufacturer: Samtec; Voltage Rating: 550V; Conn Orientation: Straight; Number Of Contacts: 4; Conn Gender: Male; Current Rating: 6.3A; Number Of Rows: 2; Category: Conn; Temperature: -55°C to +125°C; Automotive: No; Digikey Description: CONN HEADER VERT 4POS 2.54MM; ComponentLink2URL: http://suddendocs.samtec.com/catalog_english/htsw_th.pdf; Device Class L2: Headers and Wire Housings; Mouser Description: Conn Unshrouded Header HDR 4 POS 2.54mm Solder ST Thru-Hole Bag; Manufacturer Part Number: HTSW-102-07-G-D; Temperature Range High: +125°C; Contact Material: Gold,Nickel; Temperature Range Low: -55°C; ComponentLink2Description: Datasheet; Device Class L1: Connectors; Pitch: 2.54mm; Octopart: https://octopart.com/htsw-102-07-g-d-samtec-10531767; RoHS: TRUE; Package: HTSW-102-07-G-D; Lead Free: Yes; Device Class L3: unset; Height: 8.71mm
Switch_frequencey_ranges? = CMP-02766-000010-1: CONN HEADER VERT 4POS 2.54MM; Manufacturer: Samtec; Manufacturer Part Number: HTSW-102-07-G-D; Voltage Rating: 550V; Conn Orientation: Straight; Number Of Contacts: 4; Conn Gender: Male; Current Rating: 6.3A; Number Of Rows: 2; Category: Conn; Temperature: -55°C to +125°C; Automotive: No; Digikey Description: CONN HEADER VERT 4POS 2.54MM; ComponentLink2URL: http://suddendocs.samtec.com/catalog_english/htsw_th.pdf; Device Class L2: Headers and Wire Housings; Mouser Description: Conn Unshrouded Header HDR 4 POS 2.54mm Solder ST Thru-Hole Bag; Temperature Range High: +125°C; Contact Material: Gold,Nickel; Temperature Range Low: -55°C; ComponentLink2Description: Datasheet; Device Class L1: Connectors; Pitch: 2.54mm; Octopart: https://octopart.com/htsw-102-07-g-d-samtec-10531767; RoHS: TRUE; Package: HTSW-102-07-G-D; Lead Free: Yes; Device Class L3: unset; Height: 8.71mm
U?#1-U?#3 = CMP-0017-00950-2: Dual Low-Noise JFET-Input General-Purpose Operational Amplifier, 7 to 36 V, 0 to 70 degC, 8-pin DIP (P8), Pb-Free (RoHS); Manufacturer: Texas Instruments; Sub Family: General Purpose Amplifier, High Supply Voltage Amplifier (>=30V); Total Supply Voltage(Max)(+5V is 5, +/-5V is 10): 36; Slew Rate(Typ)(V/us): 13; Vn at 1kHz(Typ)(nV/rtHz): 18; GBW(Typ)(MHz): 3; CMRR(Min)(dB): 70; Total Supply Voltage(Min)(+5V is 5, +/-5V is 10): 7; Vio (25C)(Max)(mV): 10; Rating: Catalog; IIB(Max)(pA): 200; Iq per channel(Max)(mA): 2.5; Number of Channels: 2; Mounting Technology: Through Hole; ComponentLink3Description: Package Specification; PartNumber: TL072CP; PackageVersion: 4040082/E, 04/2010; Eco-Plan: Pb-Free (RoHS); DatasheetVersion: SLOS080J; Offset Drift(Typ)(uV/C): 18; ComponentLink3URL: http://www.ti.com/litv/pdf/mpdi001b; PackageDescription: 8-Pin Plastic In-Line, Body 9.59 x 6.35 mm, Pitch 2.54 mm; Code_JEDEC: MS-001; ComponentLink2URL: http://www.ti.com/lit/ds/symlink/tl072.pdf; ComponentLink1Description: Manufacturer URL; ComponentLink2Description: Datasheet; ComponentLink1URL: http://www.ti.com/; PackageReference: P0008A